# EAGLE design plantSensor (EAGLE 6.4)
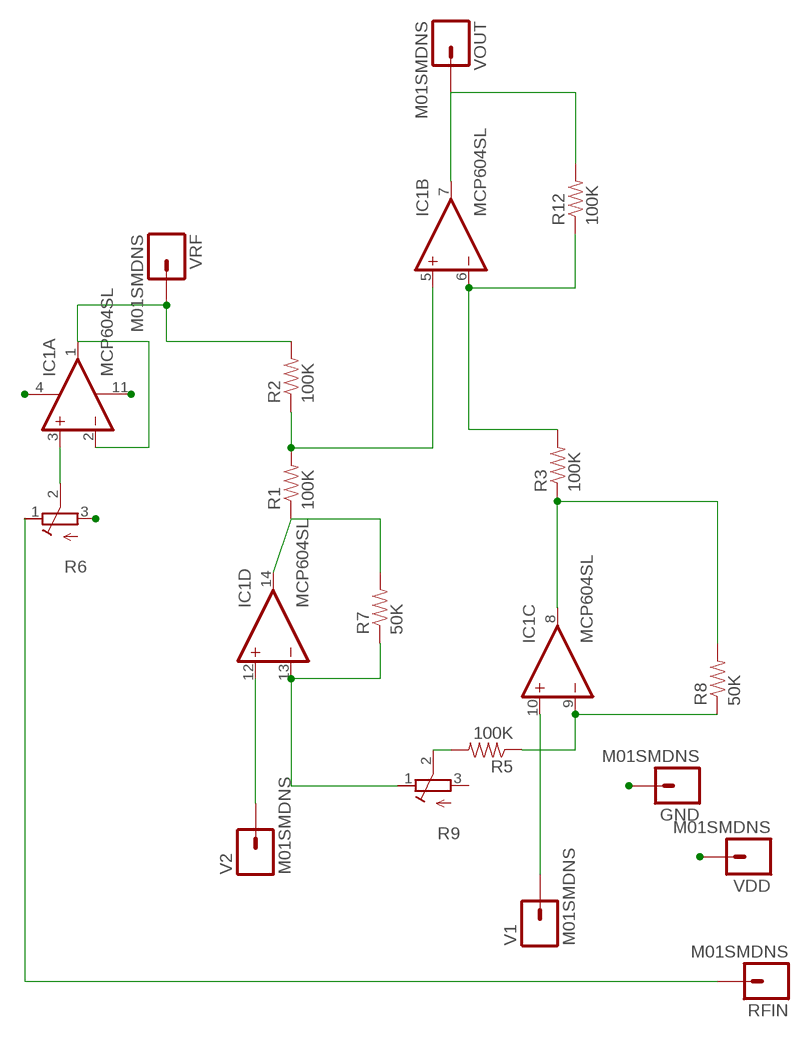
[diagram p0: schematic, sheet 1]

## Parts
GND  M01SMDNS  [1X01NS]
IC1  MCP604SL  [SO14]
R1  100K  RESISTOR  [0805]
R2  100K  RESISTOR  [0805]
R3  100K  RESISTOR  [0805]
R5  100K  RESISTOR  [0805]
R6  R-TRIMM3314G  [RTRIM3314G]
R7  50K  RESISTOR  [0805]
R8  50K  RESISTOR  [0805]
R9  R-TRIMM3314G  [RTRIM3314G]
R12  100K  RESISTOR  [0805]
RFIN  M01SMDNS  [1X01NS]
V1  M01SMDNS  [1X01NS]
V2  M01SMDNS  [1X01NS]
VDD  M01SMDNS  [1X01NS]
VOUT  M01SMDNS  [1X01NS]
VRF  M01SMDNS  [1X01NS]

## Nets
GND: GND.1 IC1.11(P:V-) R6.3(A)
N$1: IC1.10(C:+IN) V1.1
N$2: R5.2 R9.2(S)
N$3: IC1.13(D:-IN) R7.1 R9.1(E)
N$4: IC1.12(D:+IN) V2.1
N$5: R6.1(E) RFIN.1
N$6: IC1.3(A:+IN) R6.2(S)
N$7: IC1.5(B:+IN) R1.2 R2.1
N$92: IC1.9(C:-IN) R5.1 R8.1
N$93: IC1.8(C:OUT) R3.1 R8.2
N$96: IC1.14(D:OUT) R1.1 R7.2
N$100: IC1.6(B:-IN) R3.2 R12.1
N$102: IC1.7(B:OUT) R12.2 VOUT.1
VDD: IC1.4(P:V+) VDD.1
VRF: IC1.1(A:OUT) IC1.2(A:-IN) R2.2 VRF.1
Unconnected: R9.3(A)

## Library data of the parts
GND RFIN V1 V2 VDD VOUT VRF = SparkFun-Connectors:M01: Header 1 Standard 1-pin 0.1" header. Use with straight break away headers (SKU : PRT-00116), right angle break away headers (PRT-00553), swiss pins (PRT-00743), machine pins (PRT-00117), and female headers (PRT-00115).
IC1 = linear:MCP604: Quad Op Amp 2.7V to 6.0V Single Supply CMOS Source: http://ww1.microchip.com/downloads/en/DeviceDoc/21314g.pdf
R1-R3 R5 R7 R8 R12 = SparkFun:RESISTOR: Resistor Basic schematic elements and footprints for 0603, 1206, and PTH 1/10th watt (small) resistors.
R6 R9 = rcl:R-TRIMM: Trimm resistor

## Board
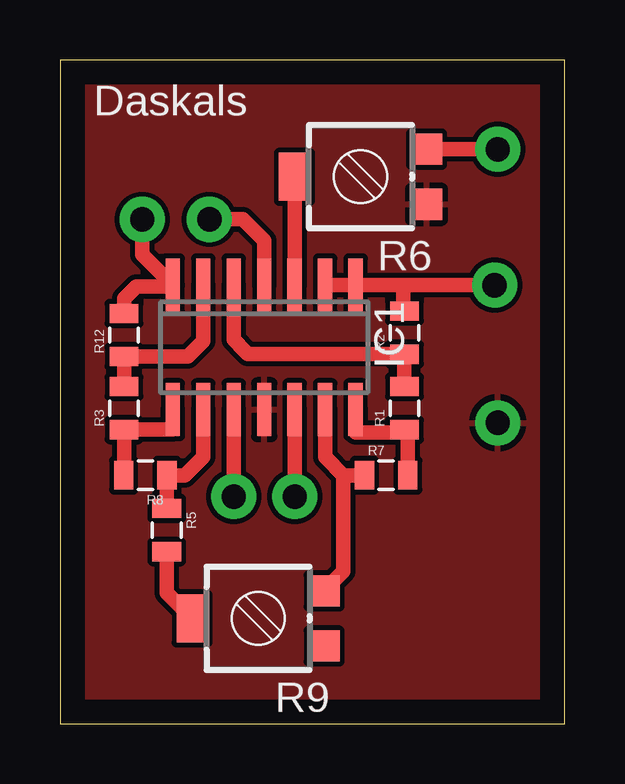
[diagram p1: board, top side]
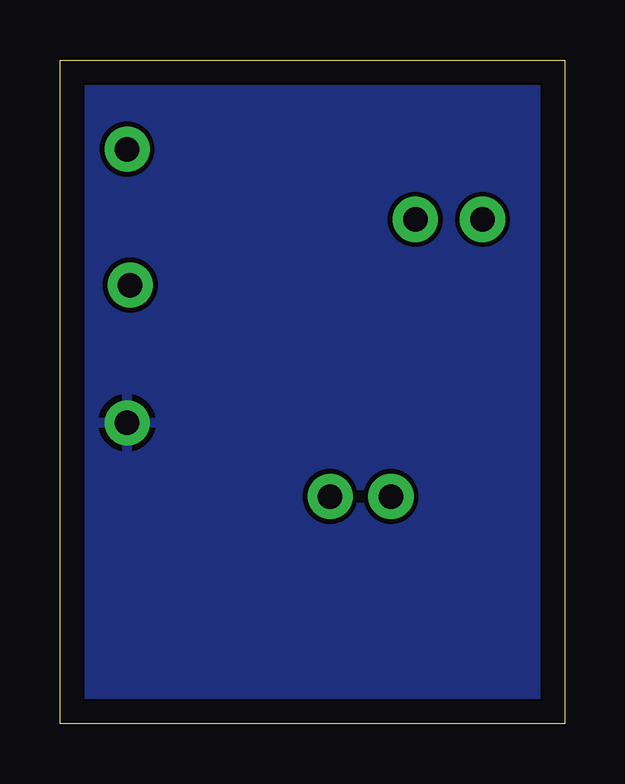
[diagram p2: board, bottom side, seen from below]

Size 21.03 x 27.68 mm. Coordinates in mm from the lower left corner, seen from the top.
Outline: 0,0 21.03,0 21.03,27.68 0,27.68 0,0
Copper layers (1*16): Top 0.035mm / dielectric 1.5mm / Bottom 0.035mm
Design rules "default": minimum track width 10mil, minimum drill 24mil, track to track 8mil, track to pad 8mil, pad to pad 8mil, via to via 8mil, smd to smd 8mil, copper to edge 40mil, drill to drill 8mil, minimum pad ring 10mil, minimum via ring 8mil, stop-mask expansion 4mil, vias tented up to drill 0mil, thermal gap 10mil

### Footprints (pad centres in the part's own frame; a part is rotated, then mirrored left to right if it is on the bottom)
1X01NS = drill 1.016 pad 1.88: 1 0,0
SO14 = smd 0.6 x 2.2: 1 -3.81,-2.6; 2 -2.54,-2.6; 3 -1.27,-2.6; 4 0,-2.6; 5 1.27,-2.6; 6 2.54,-2.6; 7 3.81,-2.6; 8 3.81,2.6; 9 2.54,2.6; 10 1.27,2.6; 11 0,2.6; 12 -1.27,2.6; 13 -2.54,2.6; 14 -3.81,2.6
0805 = smd 0.8 x 1.2: 1 -0.9,0; 2 0.9,0
RTRIM3314G = smd 1.3 x 1.3: 1 1.15,-2.75; 3 -1.15,-2.75 | smd 2 x 1.3: 2 0,2.75

### Placement (x,y rotation side)
GND  18.24,12.55 0 top
IC1  8.51,15.7 180 top
R1  14.35,13.16 90 top
R2  14.35,16.31 90 top
R3  2.67,13.16 90 top
R5  4.44,8.08 270 top
R6  12.52,22.81 90 top
R7  13.59,10.36 0 top
R8  3.56,10.36 180 top
R9  8.25,4.39 90 top
R12  2.67,16.21 90 top
RFIN  18.24,23.95 0 top
V1  7.24,9.47 0 top
V2  9.78,9.47 0 top
VDD  6.22,21.03 0 top
VOUT  3.43,21.03 0 top
VRF  18.11,18.29 0 top

### Tracks (layer width: path | path; a pad name or v marks a point on that pad's centre or on a via)
GND
  pour Top: -1.4,28.65 24.54,28.58 24.16,-1.78 -0.89,-1.32 -1.4,23.83
  pour Bottom: -2.39,30.3 -2.41,-3.35 26.24,-3.73 26.24,30.4
N$1
  Top 0.61: IC1.10 V1.1
N$2
  Top 0.61: R5.2 4.44,5.45 R9.2
N$3
  Top 0.61: IC1.13 11.05,11.13 11.81,10.36 | 11.81,10.36 R7.1 | 11.81,10.36 11.81,6.35 R9.1
N$4
  Top 0.61: IC1.12 V2.1
N$5
  Top 0.61: R6.1 18.23,23.96 RFIN.1
N$6
  Top 0.61: R6.2 IC1.3
N$7
  Top 0.61: R1.2 R2.1 7.82,15.42 7.47,15.77 7.47,15.8 7.24,16.03 IC1.5
N$92
  Top 0.61: IC1.9 5.97,11.13 5.21,10.36 R8.1 R5.1
N$93
  Top 0.254: R3.1 2.78,12.26 | 2.67,10.76 R8.2
  Top 0.61: R8.2 R3.1 4.7,12.27 IC1.8
N$96
  Top 0.61: IC1.14 12.32,12.14 14.61,12.14 14.49,12.26 R1.1 14.49,12.12 R7.2
N$100
  Top 0.61: R3.2 R12.1 5.32,15.31 5.97,15.95 IC1.6
N$102
  Top 0.61: R12.2 2.67,17.73 3.18,18.24 4.64,18.24 IC1.7 3.43,19.57 VOUT.1
VDD
  Top 0.61: VDD.1 7.62,21.03 8.51,20.14 IC1.4
VRF
  Top 0.61: IC1.2 IC1.1 14.3,18.3 | 14.3,18.3 VRF.1 | R2.2 14.3,17.21 14.3,18.3

### Text on the board
tPlace: Daskals